# Altium schematic sheet MCU.SchDoc
size A; SheetNumber: 2; SheetTotal: 3
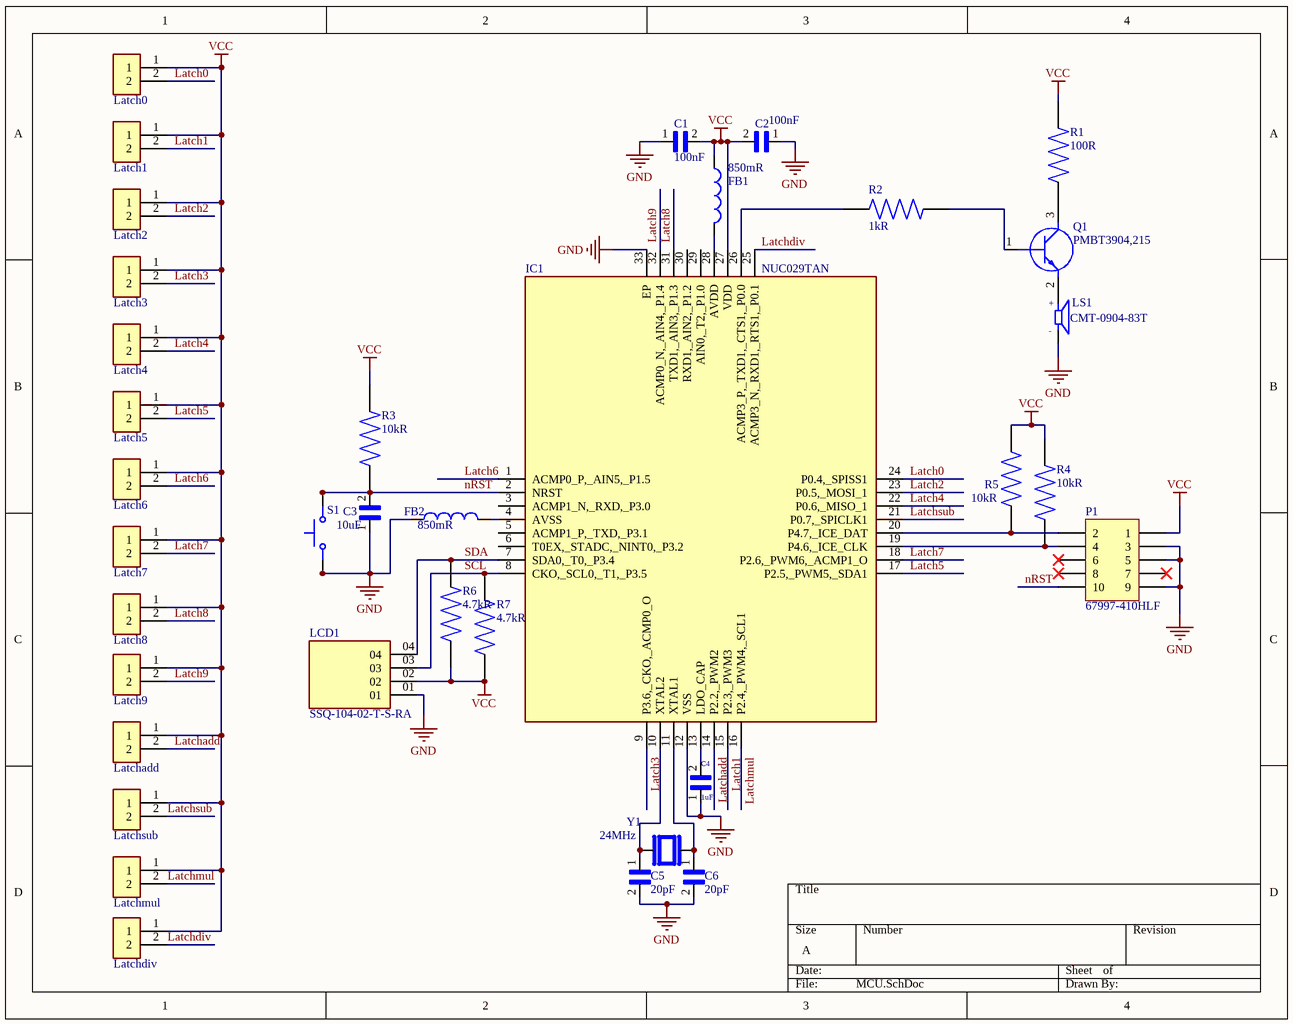
[diagram p0: MCU.SchDoc]

## Parts
C1  100nF  [CAPC1005X55N]
C2  100nF  [CAPC1005X55N]
C3  10uF  [CAPC2012X140N]
C4  1uF  [CAPC1005X55N]
C5  20pF  [CAPC1005X55N]
C6  20pF  [CAPC1005X55N]
FB1  850mR  [0603]
FB2  850mR  [0603]
IC1  NUC029TAN  [QFN40P400X400X80-33N]
Latch0  (no value)  [JST_B2B-PH-K-S(LF)(SN)]
Latch1  B2B-PH-K-S(LF)(SN)  [JST_B2B-PH-K-S(LF)(SN)]  (value not drawn)
Latch2  B2B-PH-K-S(LF)(SN)  [JST_B2B-PH-K-S(LF)(SN)]  (value not drawn)
Latch3  B2B-PH-K-S(LF)(SN)  [JST_B2B-PH-K-S(LF)(SN)]  (value not drawn)
Latch4  B2B-PH-K-S(LF)(SN)  [JST_B2B-PH-K-S(LF)(SN)]  (value not drawn)
Latch5  B2B-PH-K-S(LF)(SN)  [JST_B2B-PH-K-S(LF)(SN)]  (value not drawn)
Latch6  B2B-PH-K-S(LF)(SN)  [JST_B2B-PH-K-S(LF)(SN)]  (value not drawn)
Latch7  B2B-PH-K-S(LF)(SN)  [JST_B2B-PH-K-S(LF)(SN)]  (value not drawn)
Latch8  B2B-PH-K-S(LF)(SN)  [JST_B2B-PH-K-S(LF)(SN)]  (value not drawn)
Latch9  B2B-PH-K-S(LF)(SN)  [JST_B2B-PH-K-S(LF)(SN)]  (value not drawn)
Latchadd  B2B-PH-K-S(LF)(SN)  [JST_B2B-PH-K-S(LF)(SN)]  (value not drawn)
Latchdiv  B2B-PH-K-S(LF)(SN)  [JST_B2B-PH-K-S(LF)(SN)]  (value not drawn)
Latchmul  B2B-PH-K-S(LF)(SN)  [JST_B2B-PH-K-S(LF)(SN)]  (value not drawn)
Latchsub  B2B-PH-K-S(LF)(SN)  [JST_B2B-PH-K-S(LF)(SN)]  (value not drawn)
LCD1  SSQ-104-02-T-S-RA  [SAMTEC_SSQ-104-02-T-S-RA]
LS1  CMT-0904-83T  [XDCR_CMT-0904-83T]
P1  67997-410HLF  [HDR2X5]
Q1  PMBT3904,215  [SOT95P230X110-3N]
R1  100R  [RESC1005X35N]
R2  1kR  [RESC1005X35N]
R3  10kR  [RESC1005X40]
R4  10kR  [RESC1005X40]
R5  10kR  [RESC1005X40]
R6  4.7kR  [RESC1005X40]
R7  4.7kR  [RESC1005X40]
S1  TL3315NF100Q  [SW_TL3315NF100Q]  (value not drawn)
Y1  24MHz  [OSC_XRCGB24M000F0L00R0]

## Nets
GND: C1.1 C2.1 C3.1 C4.1 C5.2 C6.2 FB2.1 IC1.12(VSS) IC1.33(EP) LCD1.01 LS1.N P1.3 P1.5 P1.9 S1.1 S1.2
VCC: C1.2 C2.2 FB1.2 IC1.27(VDD) Latch0.1 Latch1.1 Latch2.1 Latch3.1 Latch4.1 Latch5.1 Latch6.1 Latch7.1 Latch8.1 Latch9.1 Latchadd.1 Latchdiv.1 Latchmul.1 Latchsub.1 LCD1.02 P1.1 R1.2 R3.2 R4.2 R5.2 R6.2 R7.2
Latch0: IC1.24(P0.4,_SPISS1) Latch0.2
Latch1: IC1.15(P2.3,_PWM3) Latch1.2
Latch2: IC1.23(P0.5,_MOSI_1) Latch2.2
Latch3: IC1.9(P3.6,_CKO,_ACMP0_O) Latch3.2
Latch4: IC1.22(P0.6,_MISO_1) Latch4.2
Latch5: IC1.17(P2.5,_PWM5,_SDA1) Latch5.2
Latch6: IC1.1(ACMP0_P,_AIN5,_P1.5) Latch6.2
Latch7: IC1.18(P2.6,_PWM6,_ACMP1_O) Latch7.2
Latch8: IC1.31(TXD1,_AIN3,_P1.3) Latch8.2
Latch9: IC1.32(ACMP0_N,_AIN4,_P1.4) Latch9.2
Latchadd: IC1.14(P2.2,_PWM2) Latchadd.2
Latchdiv: IC1.25(ACMP3_N,_RXD1,_RTS1,_P0.1) Latchdiv.2
Latchmul: IC1.16(P2.4,_PWM4,_SCL1) Latchmul.2
Latchsub: IC1.21(P0.7,_SPICLK1) Latchsub.2
nRST: C3.2 IC1.2(NRST) P1.10 R3.1 S1.3 S1.4
SCL: IC1.8(CKO,_SCL0,_T1,_P3.5) LCD1.03 R7.1
SDA: IC1.7(SDA0,_T0,_P3.4) LCD1.04 R6.1
NetC4_2: C4.2 IC1.13(LDO_CAP)
NetC5_1: C5.1 IC1.10(XTAL2) Y1.1
NetC6_1: C6.1 IC1.11(XTAL1) Y1.3
NetFB1_1: FB1.1 IC1.28(AVDD)
NetFB2_2: FB2.2 IC1.4(AVSS)
NetIC1_19: IC1.19(P4.6,_ICE_CLK) P1.4 R4.1
NetIC1_20: IC1.20(P4.7,_ICE_DAT) P1.2 R5.1
NetIC1_26: IC1.26(ACMP3_P,_TXD1,_CTS1,_P0.0) R2.1
NetLS1_P: LS1.P Q1.2(E)
NetQ1_1: Q1.1(B) R2.2
NetQ1_3: Q1.3(C) R1.1

Not connected (* = marked no-connect by the designer): IC1 3(ACMP1_N,_RXD,_P3.0) 5(ACMP1_P,_TXD,_P3.1) 6(T0EX,_STADC,_NINT0,_P3.2) 29(AIN0,_T2,_P1.0) 30(RXD1,_AIN2,_P1.2); P1 6* 7* 8*

## Notes on the sheet
- (in symbol CMT-0904-83T) +; -

## Library data of the parts
C1 C2 = CL05A104KA5NNNC: Prices include import duty and tax. CAP, 0.1UF, 25V, MLCC, 0402; SVHC: No SVHC (15-Jan-2019); Manufacturer: Samsung; Tolerance: 10%; Dielectric: X5R; Supplier 1: Digi-Key; Manufacturer Part Number: CL05A104KA5NNNC; RoHS: Yes; Category: Ceramic Capacitors; Stock 1: 3456201; Pricing 1: 1=0.10000, 10=0.01200, 50=0.00640, 100=0.00520, 500=0.00370, 1000=0.00291, 2500=0.00264, 5000=0.00243 (USD); Mount: Surface Mount; Case/Package: 0402; Case Code (Imperial): 0402; Case Code (Metric): 1005; Min Operating Temperature: -55°C; Max Operating Temperature: 85°C; Capacitance: 100nF; Packaging: Tape and Reel; Package Quantity: 1; Voltage Rating: 25V; Voltage: 25V; Voltage Rating (DC): 25V; Length: 1mm; Width: 0.02inch; Height: 0.5mm; Thickness: 0.022inch; Depth: 0.5mm; Radiation Hardening: No; Lead Free: Lead Free; ComponentLink1URL: https://datasheet.ciiva.com/25802/cl05a104ka5nnnc-25802704.pdf?src-supplier=Digi-Key; ComponentLink1Description: https://datasheet.ciiva.com/25802/cl05a104ka5nnnc-25802704.pdf?src-supplier=Digi-Key; ComponentLink2URL: https://datasheet.ciiva.com/16437/cl05a104ka5nnnc-16437369.pdf?src-supplier=Future+Electronics; ComponentLink2Description: https://datasheet.ciiva.com/16437/cl05a104ka5nnnc-16437369.pdf?src-supplier=Future+Electronics; ComponentLink3URL: https://datasheet.ciiva.com/26838/getdatasheetpartid-357412-26838142.pdf?src-supplier=Verical; ComponentLink3Description: https://datasheet.ciiva.com/26838/getdatasheetpartid-357412-26838142.pdf?src-supplier=Verical; ComponentLink4URL: https://datasheet.ciiva.com/26309/mlcc-catalogdownload2013-eng-26309014.pdf?src-supplier=Distrelec; ComponentLink4Description: https://datasheet.ciiva.com/26309/mlcc-catalogdownload2013-eng-26309014.pdf?src-supplier=Distrelec
C3 = GRM21BR61E106MA73L: MURATA - GRM21BR61E106MA73L - SMD Multilayer Ceramic Capacitor, 10 µF, 25 V, 0805 [2012 Metric], ± 20%, X5R, GRM Series; Voltage Rating: 25V; Supplier 1: Digi-Key; Manufacturer: Murata; Manufacturer Part Number: GRM21BR61E106MA73L; RoHS: Yes; Category: Ceramic Capacitors; Stock 1: 389936; Pricing 1: 1=0.26000, 10=0.17900, 50=0.11960, 100=0.10170, 500=0.07176, 1000=0.06279 (USD); Mount: Surface Mount; Case/Package: 0805; Case Code (Metric): 2012; Case Code (Imperial): 0805; Weight: 0.000335oz; Min Operating Temperature: -55°C; Max Operating Temperature: 85°C; Capacitance: 10uF; Tolerance: 20%; Packaging: Tape and Reel; Dielectric: X5R; Termination: SMD/SMT; Resistor Type: Ceramic; Voltage Rating (DC): 25V; Package Quantity: 3000; Length: 2mm; Width: 0.049inch; Height: 1.25mm; Thickness: 0.055inch; Depth: 1.25mm; REACH SVHC: No SVHC; Lead Free: Lead Free; RoHS Compliant: Yes; ComponentLink1URL: http://www.farnell.com/datasheets/2079185.pdf?src-supplier=Farnell; ComponentLink1Description: http://www.farnell.com/datasheets/2079185.pdf?src-supplier=Farnell; ComponentLink2URL: http://www.mouser.com/ds/2/281/c02e-2905.pdf?src-supplier=Mouser; ComponentLink2Description: http://www.mouser.com/ds/2/281/c02e-2905.pdf?src-supplier=Mouser; ComponentLink3URL: http://components.arrow.com/part/dataview/0323_03061623?src-supplier=Arrow+Europe; ComponentLink3Description: http://components.arrow.com/part/dataview/0323_03061623?src-supplier=Arrow+Europe; ComponentLink4URL: https://search.murata.co.jp/Ceramy/image/img/A01X/G101/ENG/GRM21BR61E106MA73-01.pdf?src-supplier=Digi-Key; ComponentLink4Description: https://search.murata.co.jp/Ceramy/image/img/A01X/G101/ENG/GRM21BR61E106MA73-01.pdf?src-supplier=Digi-Key; ComponentLink5URL: http://www.farnell.com/datasheets/2079185.pdf?src-supplier=Element14; ComponentLink5Description: http://www.farnell.com/datasheets/2079185.pdf?src-supplier=Element14
C4 = LMK105BJ105KV-F: Cap Ceramic 1uF 10V X5R 10% Pad SMD 0402 85°C T/R; Manufacturer: Taiyo Yuden; Supplier 1: Digi-Key; Supplier Part Number 1: 587-1454-1-ND; Manufacturer Part Number: LMK105BJ105KV-F; RoHS: Yes; Category: Ceramic Capacitors; Stock 1: 1517627; Pricing 1: 1=0.11000, 10=0.08200, 50=0.04480, 100=0.03660, 500=0.02616, 1000=0.02056, 2500=0.01869, 5000=0.01719 (USD); Mount: Surface Mount; Case/Package: 0402; Case Code (Imperial): 0402; Case Code (Metric): 1005; Min Operating Temperature: -55°C; Max Operating Temperature: 85°C; Capacitance: 1uF; Tolerance: 10%; Dielectric: X5R; Packaging: Tape and Reel; Voltage Rating (DC): 10V; Package Quantity: 1; Voltage Rating: 10V; Termination: SMD/SMT; Series: M; Construction: Flat; Resistor Type: Ceramic; Length: 1mm; Width: 0.5mm; Height: 0.5mm; Depth: 0.5mm; Thickness: 0.022inch; Radiation Hardening: No; Lead Free: Lead Free; Halogen Free: Halogen Free; REACH SVHC: Unknown; RoHS Compliant: Yes; ComponentLink1URL: https://datasheet.ciiva.com/131/lmk105bj105kv-f-ss-131735.pdf?src-supplier=Digi-Key; ComponentLink1Description: https://datasheet.ciiva.com/131/lmk105bj105kv-f-ss-131735.pdf?src-supplier=Digi-Key; ComponentLink2URL: https://datasheet.ciiva.com/15921/463lmk105bj105kv-f-15921218.pdf?src-supplier=Onlinecomponents.com; ComponentLink2Description: https://datasheet.ciiva.com/15921/463lmk105bj105kv-f-15921218.pdf?src-supplier=Onlinecomponents.com; ComponentLink3URL: https://datasheet.ciiva.com/26872/getdatasheetpartid-637441-26872608.pdf?src-supplier=Verical; ComponentLink3Description: https://datasheet.ciiva.com/26872/getdatasheetpartid-637441-26872608.pdf?src-supplier=Verical; ComponentLink4URL: https://datasheet.ciiva.com/30256/308lmk105bj105kv-f-30256903.pdf?src-supplier=Onlinecomponents.com; ComponentLink4Description: https://datasheet.ciiva.com/30256/308lmk105bj105kv-f-30256903.pdf?src-supplier=Onlinecomponents.com
C5 C6 = GRM1555C1H200JA01D: CAP CER 20PF 50V C0G/NP0 0402; Manufacturer: Murata; Material: Ceramic; Tolerance: 5%; Dielectric: C0G; Supplier 1: Digi-Key; Manufacturer Part Number: GRM1555C1H200JA01D; RoHS: Yes; Category: Ceramic Capacitors; Stock 1: 1090856; Pricing 1: 1=0.10000, 10=0.05800, 50=0.03180, 100=0.02590, 500=0.01852, 1000=0.01455, 2500=0.01322, 5000=0.01217 (USD); Mount: Surface Mount; Case/Package: 0402; Case Code (Metric): 1005; Case Code (Imperial): 0402; Min Operating Temperature: -55°C; Max Operating Temperature: 125°C; Capacitance: 20pF; Voltage Rating: 50V; Packaging: Tape and Reel; Voltage Rating (DC): 50V; Package Quantity: 10000; Termination: SMD/SMT; Series: GRM; Construction: Flat; Voltage: 50V; Length: 1mm; Width: 0.5mm; Height: 0.5mm; Thickness: 0.022inch; Depth: 0.5mm; Radiation Hardening: No; RoHS Compliant: Yes; Lead Free: Lead Free; REACH SVHC: No SVHC; ComponentLink1URL: https://datasheet.ciiva.com/18184/getdatasheetpartid-318562-18184258.pdf?src-supplier=Verical; ComponentLink1Description: https://datasheet.ciiva.com/18184/getdatasheetpartid-318562-18184258.pdf?src-supplier=Verical; ComponentLink2URL: https://datasheet.ciiva.com/6263/grm1555c1h200ja01-01-6263897.pdf?src-supplier=Digi-Key; ComponentLink2Description: https://datasheet.ciiva.com/6263/grm1555c1h200ja01-01-6263897.pdf?src-supplier=Digi-Key; ComponentLink3URL: https://datasheet.ciiva.com/16507/l0005e-16507883.pdf?src-supplier=Future+Electronics; ComponentLink3Description: https://datasheet.ciiva.com/16507/l0005e-16507883.pdf?src-supplier=Future+Electronics; ComponentLink4URL: https://datasheet.ciiva.com/6263/partnumbering-e-01-6263900.pdf?src-supplier=Digi-Key; ComponentLink4Description: https://datasheet.ciiva.com/6263/partnumbering-e-01-6263900.pdf?src-supplier=Digi-Key; ComponentLink5URL: https://datasheet.ciiva.com/7828/1666664-7828845.pdf?src-supplier=Element14; ComponentLink5Description: https://datasheet.ciiva.com/7828/1666664-7828845.pdf?src-supplier=Element14; ComponentLink6URL: https://datasheet.ciiva.com/6263/partnumbering-e-01-6263903.pdf?src-supplier=Digi-Key; ComponentLink6Description: https://datasheet.ciiva.com/6263/partnumbering-e-01-6263903.pdf?src-supplier=Digi-Key
FB1 FB2 = Inductor: FERRITE BEAD 1 KOHM 0603 1 LN; Manufacturer: Murata; Manufacturer Part Number: BLM18BD102BH1D; Number of Lines: 1; Max Current Rating: 200mA; Supplier 1: Digi-Key; RoHS: Yes; Category: Ferrite Beads and Chips; Stock 1: 790; Pricing 1: 1=0.12000, 10=0.09900, 25=0.07680, 50=0.06380, 100=0.05500, 250=0.04400, 500=0.03960, 1000=0.03300 (USD); Case/Package: 0603; Case Code (Metric): 1608; Case Code (Imperial): 0603; Min Operating Temperature: -55°C; Max Operating Temperature: 150°C; DC Resistance (DCR): 850mR; Ratings: AEC-Q200; RoHS Compliant: Yes; ComponentLink1URL: http://www.murata.com/en-us/products/productdata/8798137286686/QNFA9129.pdf?src-supplier=Digi-Key; ComponentLink1Description: http://www.murata.com/en-us/products/productdata/8798137286686/QNFA9129.pdf?src-supplier=Digi-Key; ComponentLink2URL: https://www.murata.com/en-us/products/productdata/8796733866014/S0594E.pdf?src-supplier=Digi-Key; ComponentLink2Description: https://www.murata.com/en-us/products/productdata/8796733866014/S0594E.pdf?src-supplier=Digi-Key
IC1 = NUC029TAN: Integrated Circuit; Manufacturer: Nuvoton; Supplier 1: Digi-Key; Manufacturer Part Number: NUC029TAN; RoHS: Yes; Stock 1: 490; Pricing 1: 1=1.92000, 10=1.72200, 25=1.62480, 80=1.38450, 230=1.30000, 490=1.13751, 980=0.94250, 2450=0.87750, 4900=0.84500 (USD)
Latch0-Latch9 Latchadd Latchdiv Latchmul Latchsub = B2B-PH-K-S(LF)(SN): Connector Header, PH Series, 2 Position, 2.00mm, Through Hole, Press-Fit, Solder, Natural; Manufacturer: JST; Manufacturer Part Number: B2BPHKSLFSN; Current Rating: 2A; Number of Positions: 2; Contact Resistance: 20mR; Insulation Resistance: 1MR; Gender: Male; Voltage Rating: 100V; Pitch: 2mm; Contact Post Length: 0.134inch; Mated Stacking Heights: 8mm; Supplier 1: Arrow Electronics; RoHS: Yes; Category: Connectors; Mount: Through Hole; Number of Pins: 2; Contact Material: Brass; Contact Plating: Tin,Copper; Color: Natural; Housing Color: White; Housing Material: Polyamide; Contact Shape: Square; Contact Finish - Mating: TIN; Insulation Material: Nylon; Insulation Color: Natural; Min Operating Temperature: -25°C; Max Operating Temperature: 85°C; Connector Type: Header; Termination: Press-Fit; Number of Rows: 1; Packaging: Bulk; Fastening Type: Detent; Number of Contacts: 2; Orientation: Straight; Series: PH; Contact Type: Male Pin; Max Current Rating: 2A; Number of Poles: 2; Voltage Rating (AC): 100V; Max Voltage Rating (AC): 100V; Working Voltage: 100V; Max Voltage Rating (DC): 100V; Length: 5.9mm; Width: 4.5mm; Height: 9.4mm; Contact Mating Length: 0.13inch; Lead Pitch: 2mm; Depth: 4.5mm; Insulation Height: 0.236inch; Lead Free: Lead Free; REACH SVHC: No SVHC; Flammability Rating: UL94 V-0; ComponentLink1URL: https://datasheet.ciiva.com/6747/80560-6747392.pdf?src-supplier=Newark; ComponentLink1Description: https://datasheet.ciiva.com/6747/80560-6747392.pdf?src-supplier=Newark; ComponentLink2URL: https://datasheet.ciiva.com/11746/0900766b8082f551-11746676.pdf?src-supplier=RSComponents; ComponentLink2Description: https://datasheet.ciiva.com/11746/0900766b8082f551-11746676.pdf?src-supplier=RSComponents; ComponentLink3URL: https://datasheet.ciiva.com/712/eph-712442.pdf?src-supplier=Digi-Key; ComponentLink3Description: https://datasheet.ciiva.com/712/eph-712442.pdf?src-supplier=Digi-Key; ComponentLink4URL: https://datasheet.ciiva.com/8052/80560-8052022.pdf?src-supplier=Element14; ComponentLink4Description: https://datasheet.ciiva.com/8052/80560-8052022.pdf?src-supplier=Element14; ComponentLink5URL: https://datasheet.ciiva.com/16422/b2b-ph-k-slfsn-16422715.pdf?src-supplier=Future+Electronics; ComponentLink5Description: https://datasheet.ciiva.com/16422/b2b-ph-k-slfsn-16422715.pdf?src-supplier=Future+Electronics
LCD1 = SSQ-104-02-T-S-RA: Conn Socket Strip SKT 4 POS 2.54mm Solder RA Thru-Hole Bulk; Manufacturer: Samtec; Gender: Female; Number of Contacts: 4; Connector Type: Receptacle,Socket; Pitch: 0.1inch; Supplier 1: Digi-Key; Manufacturer Part Number: SSQ-104-02-T-S-RA; RoHS: Yes; Category: Connectors; Stock 1: 1647; Pricing 1: 1=0.61000, 10=0.57300, 25=0.51600, 50=0.45840, 100=0.43940, 250=0.40120, 500=0.38208 (USD); Mount: Through Hole; Contact Material: Bronze; Contact Plating: Tin; Housing Color: Black; Housing Material: Plastic; Color: Black; Termination: Solder; Packaging: Bulk; Number of Rows: 1; Number of Positions: 4; Length: 10.7mm; Width: 8.51mm; Height: 2.41mm; Radiation Hardening: No; Lead Free: Lead Free; ComponentLink1URL: https://datasheet.ciiva.com/749/ssq-1xx-xx-xxx-x-xx-xxx-xx-x-mkt-749183.pdf?src-supplier=Digi-Key; ComponentLink1Description: https://datasheet.ciiva.com/749/ssq-1xx-xx-xxx-x-xx-xxx-xx-x-mkt-749183.pdf?src-supplier=Digi-Key
LS1 = CMT-0904-83T: Manufacturer: CUI Devices; Supplier 1: Digi-Key; Manufacturer Part Number: CMT-0904-83T; RoHS: Yes; Stock 1: 521; Pricing 1: 1=0.82000, 10=0.68400, 25=0.63360, 50=0.59680, 100=0.56130, 500=0.48384, 1000=0.45266, 5000=0.43890 (USD)
P1 = Header 5X2: Conn Unshrouded Header HDR 10 POS 2.54mm Solder ST Top Entry Thru-Hole BergStik® Bulk; Manufacturer: ICC; Supplier 1: Newark; Manufacturer Part Number: 67997-410HLF; RoHS: No; Category: Connectors; Stock 1: 487; Pricing 1: 1=0.34200, 10=0.23600, 25=0.23300, 50=0.23000, 100=0.22800, 250=0.21200, 500=0.19800, 1000=0.16800, 2500=0.13600, 5000=0.12800, 10000=0.11300 (USD)
Q1 = PMBT3904,215: Transistor BJT NPN; Manufacturer_Name: Nexperia; Manufacturer: CUI Devices; Manufacturer Part Number: CMT-0904-83T; Datasheet Link: http://assets.nexperia.com/documents/data-sheet/PMBT3904.pdf; Height: 1.1mm; Manufacturer_Part_Number: PMBT3904,215; Mouser Part Number: 771-PMBT3904-T/R; Mouser Price/Stock: https://www.mouser.co.uk/ProductDetail/Nexperia/PMBT3904215?qs=LOCUfHb8d9tXximHEgx1nw%3D%3D; Arrow Part Number: PMBT3904,215; Arrow Price/Stock: https://www.arrow.com/en/products/pmbt3904215/nexperia; Supplier 1: Digi-Key; RoHS: Yes; Stock 1: 521; Pricing 1: 1=0.82000, 10=0.68400, 25=0.63360, 50=0.59680, 100=0.56130, 500=0.48384, 1000=0.45266, 5000=0.43890 (USD)
R1 = RMCF0402FT100R: RES 100 OHM 1% 1/16W 0402; Manufacturer: Stackpole Electronics; Power Rating: 62.5mW; Max Power Dissipation: 63mW; Temperature Coefficient: 100ppm/°C; Supplier 1: Digi-Key; Manufacturer Part Number: RMCF0402FT100R; RoHS: Yes; Category: Chip SMD Resistors; Stock 1: 740125; Pricing 1: 1=0.10000, 10=0.01500, 100=0.00610, 1000=0.00274, 2500=0.00238, 5000=0.00197 (USD); Mount: Surface Mount; Case/Package: 0402; Case Code (Metric): 1005; Case Code (Imperial): 0402; Contact Plating: Tin,Matte; Min Operating Temperature: -55°C; Max Operating Temperature: 155°C; Resistance: 100R; Tolerance: 1%; Packaging: Tape and Reel; Resistor Type: Thick Film; Number of Terminations: 2; Features: Automotive AEC-Q200; Series: RMCF; Construction: Rectangular; Length: 1mm; Width: 0.02inch; Height: 0.016inch; Depth: 0.5mm; Military Standard: Not; Lead Free: Lead Free; RoHS Compliant: Yes; ComponentLink1URL: http://components.arrow.com/part/dataview/50497758S7215546N1174?src-supplier=Arrow+Electronics; ComponentLink1Description: http://components.arrow.com/part/dataview/50497758S7215546N1174?src-supplier=Arrow+Electronics; ComponentLink2URL: https://www.verical.com/server-webapp/html/getDatasheet?partID=368652&src-supplier=Verical; ComponentLink2Description: https://www.verical.com/server-webapp/html/getDatasheet?partID=368652&src-supplier=Verical; ComponentLink3URL: https://www.seielect.com/Catalog/SEI-RMCF_RMCP.pdf?src-supplier=Avnet+Asia; ComponentLink3Description: https://www.seielect.com/Catalog/SEI-RMCF_RMCP.pdf?src-supplier=Avnet+Asia; ComponentLink4URL: https://www.seielect.com/catalog/sei-rmcf_rmcp.pdf?src-supplier=Digi-Key; ComponentLink4Description: https://www.seielect.com/catalog/sei-rmcf_rmcp.pdf?src-supplier=Digi-Key; ComponentLink5URL: https://www.seielect.com/Catalog/SEI-RMCF_RMCP.pdf?src-supplier=Avnet; ComponentLink5Description: https://www.seielect.com/Catalog/SEI-RMCF_RMCP.pdf?src-supplier=Avnet
R2 = RMCF0402FT100R: RES 1K OHM 1% 1/16W 0402; Manufacturer: Stackpole Electronics; Manufacturer Part Number: RMCF0402FT1K00; Power Rating: 63mW; Temperature Coefficient: 100ppm/°C; Supplier 1: Digi-Key; RoHS: Yes; Category: Chip SMD Resistors; Stock 1: 6621185; Pricing 1: 1=0.10000, 10=0.01500, 100=0.00610, 1000=0.00274, 2500=0.00238, 5000=0.00197 (USD); Mount: Surface Mount; Case/Package: 0402; Case Code (Metric): 1005; Case Code (Imperial): 0402; Contact Plating: Tin,Matte; Size Code: 0402; Min Operating Temperature: -55°C; Max Operating Temperature: 155°C; Tolerance: 1%; Resistance: 1kR; Packaging: Tape and Reel; Resistor Type: Thick Film; Number of Terminations: 2; Max Power Dissipation: 63mW; Features: Automotive AEC-Q200; Series: RMCF; Construction: Rectangular; Length: 1mm; Width: 0.02inch; Height: 0.016inch; Depth: 0.5mm; Radiation Hardening: No; Military Standard: Not; Lead Free: Lead Free; RoHS Compliant: Yes; ComponentLink1URL: https://datasheet.ciiva.com/15193/getdatasheetpartid-365385-15193418.pdf?src-supplier=Verical; ComponentLink1Description: https://datasheet.ciiva.com/15193/getdatasheetpartid-365385-15193418.pdf?src-supplier=Verical; ComponentLink2URL: https://datasheet.ciiva.com/24336/sei-rmcp-24336266.pdf?src-supplier=Onlinecomponents.com; ComponentLink2Description: https://datasheet.ciiva.com/24336/sei-rmcp-24336266.pdf?src-supplier=Onlinecomponents.com
R3-R5 = RMCF0402JT10K0: RES 10K OHM 5% 1/16W 0402; Manufacturer: Stackpole Electronics; Power Rating: 62.5mW; Max Power Dissipation: 63mW; Temperature Coefficient: 100ppm/°C; Working Voltage: 50V; Supplier 1: Digi-Key; Manufacturer Part Number: RMCF0402JT10K0; RoHS: Yes; Category: Chip SMD Resistors; Stock 1: 2720859; Pricing 1: 1=0.10000, 10=0.01200, 100=0.00470, 1000=0.00213, 2500=0.00185, 5000=0.00153 (USD); Mount: Surface Mount; Case/Package: 0402; Case Code (Metric): 1005; Case Code (Imperial): 0402; Contact Plating: Tin,Matte; Min Operating Temperature: -55°C; Max Operating Temperature: 155°C; Packaging: Tape and Reel; Resistance: 10kR; Tolerance: 5%; Resistor Type: Thick Film; Number of Terminations: 2; Features: Automotive AEC-Q200; Series: RMCF; Technology: THICK FILM; Construction: Rectangular; Length: 1mm; Width: 0.02inch; Height: 0.016inch; Depth: 0.5mm; Radiation Hardening: No; Military Standard: Not; Lead Free: Lead Free; RoHS Compliant: Yes; ComponentLink1URL: https://datasheet.ciiva.com/15193/getdatasheetpartid-360689-15193431.pdf?src-supplier=Verical; ComponentLink1Description: https://datasheet.ciiva.com/15193/getdatasheetpartid-360689-15193431.pdf?src-supplier=Verical
R6 R7 = RMCF0402JT4K70: Res Thick Film 0402 4.7K Ohm 5% 1/16W 100ppm/C Molded SMD SMD Paper T/R; Manufacturer: Stackpole Electronics; Power Rating: 63mW; Temperature Coefficient: 100ppm/°C; Supplier 1: Digi-Key; Manufacturer Part Number: RMCF0402JT4K70; RoHS: Yes; Category: Chip SMD Resistors; Stock 1: 1370895; Pricing 1: 1=0.10000, 10=0.01200, 100=0.00470, 1000=0.00213, 2500=0.00185, 5000=0.00153 (USD); Mount: Surface Mount; Case/Package: 0402; Case Code (Metric): 1005; Case Code (Imperial): 0402; Contact Plating: Tin,Matte; Min Operating Temperature: -55°C; Max Operating Temperature: 155°C; Resistance: 4.7kR; Tolerance: 5%; Packaging: Tape and Reel; Resistor Type: Thick Film; Number of Terminations: 2; Max Power Dissipation: 63mW; Features: Automotive AEC-Q200; Series: RMCF; Construction: Rectangular; Length: 0.039inch; Width: 0.02inch; Height: 0.016inch; Depth: 0.5mm; Radiation Hardening: No; Lead Free: Lead Free; Military Standard: Not; RoHS Compliant: Yes; ComponentLink1URL: http://components.arrow.com/part/dataview/50582671S6490608N1174?src-supplier=Arrow+Electronics; ComponentLink1Description: http://components.arrow.com/part/dataview/50582671S6490608N1174?src-supplier=Arrow+Electronics; ComponentLink2URL: https://www.seielect.com/catalog/sei-rmcf_rmcp.pdf?src-supplier=Digi-Key; ComponentLink2Description: https://www.seielect.com/catalog/sei-rmcf_rmcp.pdf?src-supplier=Digi-Key; ComponentLink3URL: https://www.seielect.com/catalog/SEI-RMCF_RMCP.pdf?src-supplier=Avnet; ComponentLink3Description: https://www.seielect.com/catalog/SEI-RMCF_RMCP.pdf?src-supplier=Avnet
S1 = TL3315NF100Q: E-SWITCH - TL3315NF100Q - SWITCH, TACTILE, SPST, 50mA, 15VDC; Mechanical Life: 1000000Cycles; Operating Force: 100gf; Voltage Rating (DC): 15V; Contact Resistance: 200mR; Illumination Type: Non-Illuminated; Switch Travel: 0.2mm; Switch Function: Off-Mom; Actuator Length: 0mm; Supplier 1: Digi-Key; Manufacturer: E-Switch; Manufacturer Part Number: TL3315NF100Q; RoHS: Yes; Category: Tactile Switches; Stock 1: 908028; Pricing 1: 1=0.15000, 10=0.14400, 25=0.13600, 100=0.12370, 250=0.11632, 500=0.10640, 1000=0.08908, 2500=0.08661 (USD); Mount: Surface Mount; Case/Package: SMD/SMT; Color: Yellow; Contact Plating: Silver; Contact Material: Silver; Min Operating Temperature: -20°C; Max Operating Temperature: 70°C; Packaging: Tape and Reel; Current Rating: 50mA; Package Quantity: 1; Max Voltage Rating (DC): 15V; Throw Configuration: SPST; Termination: Gull Wing; Electrical Life: 1000000Cycles; Orientation: Straight; Series: TL3315; Size: 5mm; Lead Free: Lead Free; RoHS Compliant: Yes; ComponentLink1URL: https://datasheet.ciiva.com/2900/p010336b-2900756.pdf?src-supplier=Digi-Key; ComponentLink1Description: https://datasheet.ciiva.com/2900/p010336b-2900756.pdf?src-supplier=Digi-Key; ComponentLink2URL: https://datasheet.ciiva.com/5284/tl3315-7499-5284548.pdf?src-supplier=Mouser; ComponentLink2Description: https://datasheet.ciiva.com/5284/tl3315-7499-5284548.pdf?src-supplier=Mouser; ComponentLink3URL: https://datasheet.ciiva.com/2900/tl3315-2900758.pdf?src-supplier=Digi-Key; ComponentLink3Description: https://datasheet.ciiva.com/2900/tl3315-2900758.pdf?src-supplier=Digi-Key; ComponentLink4URL: https://datasheet.ciiva.com/2900/tl3315-2900757.pdf?src-supplier=Digi-Key; ComponentLink4Description: https://datasheet.ciiva.com/2900/tl3315-2900757.pdf?src-supplier=Digi-Key; ComponentLink5URL: https://datasheet.ciiva.com/16156/tl3315-16156332.pdf?src-supplier=Onlinecomponents.com; ComponentLink5Description: https://datasheet.ciiva.com/16156/tl3315-16156332.pdf?src-supplier=Onlinecomponents.com
Y1 = XRCGB24M000F0L00R0: MURATA - XRCGB24M000F0L00R0 - QUARZRESONATOR, 24MHZ, 150PPM; Frequency Tolerance: 100ppm; Load Capacitance: 6pF; ESR (Equivalent Series Resistance): 150R; Frequency Stability: 50ppm; Supplier 1: Digi-Key; Manufacturer: Murata; Manufacturer Part Number: XRCGB24M000F0L00R0; RoHS: Yes; Category: Crystals; Stock 1: 108646; Pricing 1: 1=0.32000, 10=0.26800, 50=0.24160, 100=0.21480, 500=0.20406, 1000=0.17184 (USD); Mount: Surface Mount; Case/Package: SMD/SMT; Number of Pins: 4; Min Operating Temperature: -30°C; Max Operating Temperature: 85°C; Frequency: 24MHz; Package Quantity: 3000; Packaging: Tape and Reel; Tolerance: 100ppm; Termination: SMD/SMT; Series Resistance: 150R; Series: XRCGB; Operating Frequency: 24 MHz; Length: 2mm; Width: 1.6mm; Height: 0.028inch; Depth: 1.6mm; REACH SVHC: No SVHC; Lead Free: Lead Free; RoHS Compliant: Yes; ComponentLink1URL: https://datasheet.ciiva.com/3852/part15-3852009.pdf?src-supplier=Arrow+Electronics; ComponentLink1Description: https://datasheet.ciiva.com/3852/part15-3852009.pdf?src-supplier=Arrow+Electronics; ComponentLink2URL: https://datasheet.ciiva.com/852/p79e-852274.pdf?src-supplier=Digi-Key; ComponentLink2Description: https://datasheet.ciiva.com/852/p79e-852274.pdf?src-supplier=Digi-Key; ComponentLink3URL: https://datasheet.ciiva.com/852/p79e-852275.pdf?src-supplier=Digi-Key; ComponentLink3Description: https://datasheet.ciiva.com/852/p79e-852275.pdf?src-supplier=Digi-Key; ComponentLink4URL: https://datasheet.ciiva.com/852/p79e-852276.pdf?src-supplier=Digi-Key; ComponentLink4Description: https://datasheet.ciiva.com/852/p79e-852276.pdf?src-supplier=Digi-Key; ComponentLink5URL: https://datasheet.ciiva.com/1361/l0445e-1361516.pdf?src-supplier=Element14; ComponentLink5Description: https://datasheet.ciiva.com/1361/l0445e-1361516.pdf?src-supplier=Element14; ComponentLink6URL: https://datasheet.ciiva.com/22695/1911263-22695436.pdf?src-supplier=Element14; ComponentLink6Description: https://datasheet.ciiva.com/22695/1911263-22695436.pdf?src-supplier=Element14